# Altium schematic sheet 09_RTC.SchDoc: Power and Incoming USB
size A2; Organization: Greenfield Tech Solutions; Address1: Molendreef 33; Address2: Ossendrecht; Address3: 4641CS; Address4: The Netherlands; SheetNumber: 9; SheetTotal: 11
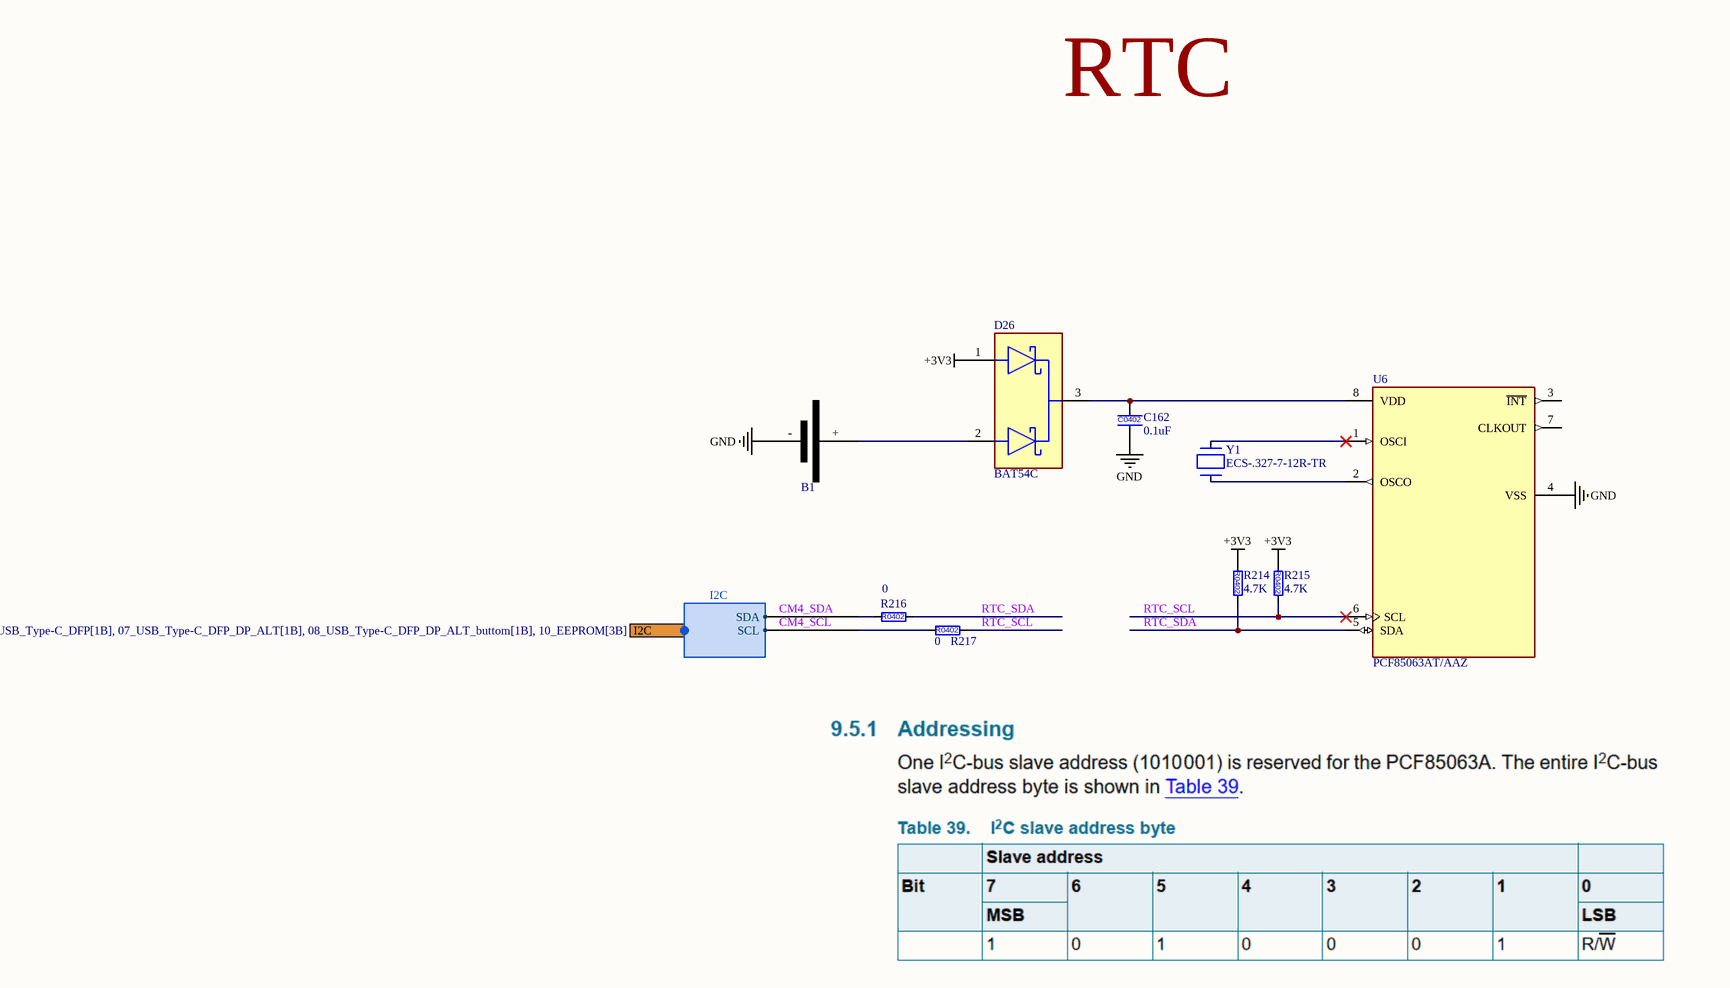
[diagram p0: 09_RTC.SchDoc]

## Parts
B1  BATTERY HOLDER CR1220  [BC501SM_CR1220]  (value not drawn)
C162  0.1uF  [C0402]
D26  BAT54C  [BAT54C_SOT_23_3]
R214  4.7K  [R0402]
R215  4.7K  [R0402]
R216  0  [R0402]
R217  0  [R0402]
U6  PCF85063AT/AAZ  [PCF85063AT_SOIC_8]
Y1  ECS-.327-7-12R-TR  [FP-ECX-12R-MFG]

## Ports
I2C (harness I2C, see 01_Top[3B], 03_RPiCM4[1B], 05_HDMI_to_DP[1B], 06_USB_Type-C_DFP[1B], 07_USB_Type-C_DFP_DP_ALT[1B], 08_USB_Type-C_DFP_DP_ALT_buttom[1B], 10_EEPROM[3B])

## Harnesses
I2C: SDA, SCL

## Nets
+3V3: D26.1(1_ANODE) R214.1 R215.1
GND: B1.- C162.2 U6.4(VSS)
CM4_SCL: R217.1 ; port I2C.SCL
CM4_SDA: R216.1 ; port I2C.SDA
RTC_SCL: R215.2 R217.2 U6.6(SCL)
RTC_SDA: R214.2 R216.2 U6.5(SDA)
NetB1_+: B1.+ D26.2(2_ANODE)
NetC162_1: C162.1 D26.3(COMMON_CATHODE) U6.8(VDD)
NetU6_1: U6.1(OSCI) Y1.1(In/Out)
NetU6_2: U6.2(OSCO) Y1.2(Out/In)

Not connected (* = marked no-connect by the designer): U6 3(~{INT}) 7(CLKOUT)

## Notes on the sheet
- RTC
- Title
- Size:
- Date:
- File:
- A2
- Number:
- Time:
- Revision:
- Sheet
- of
- (in symbol 04023D104KAT2A) C0402
- (in symbol CRCW04024K7FK) R0402
- (in symbol CRCW04020000Z0) R0402

## Library data of the parts
B1 = BC501SM: BATTERY HOLDER COIN 12MM SMD; Manufacturer: Memory Protection Devices; Number of Cells: 1; Supplier 1: Digi-Key; Manufacturer Part Number: BC501SM; RoHS: Yes; Category: Uncategorized; Stock 1: 4069; Pricing 1: 1=1.03000, 10=0.87200, 50=0.76400, 100=0.72030, 250=0.66312, 500=0.62272, 1000=0.58232, 2500=0.53183, 5000=0.49144 (USD); Mount: Surface Mount,PCB; Case/Package: SMD/SMT; Min Operating Temperature: -40°C; Max Operating Temperature: 85°C; Package Quantity: 200; Termination: SMD/SMT; ComponentLink1URL: https://datasheet.ciiva.com/4/bc501sm-datasheet-4073.pdf?src-supplier=Digi-Key; ComponentLink1Description: https://datasheet.ciiva.com/4/bc501sm-datasheet-4073.pdf?src-supplier=Digi-Key; Supplier Part Number 1: BC501SM-ND
C162 = 04023D104KAT2A: CAP CER  0.1uF 10% 25V X5R 0402; Manufacturer: AVX Corporation; Manufacturer Part Number: 04023D104KAT2A; Value: 0.1uF; Voltage - Rated: 25V; Tolerance: ±10%; Temperature Coefficient: X5R
D26 = BAT54C: BAT54 Series 30 V 200 mA Surface Mount Schottky Barrier Double Diode - SOT-23; Obsolete Part: true; Manufacturer: ON Semiconductor; Max Repetitive Reverse Voltage: 30V; Max Junction Temp: +150°C; Forward Current: 200mA; Peak Reverse Current: 2uA; Standoff Height: 0mm; Capacitance: 10pF; Max Surge Forward Current: 600mA; Value: 10pF; Element Configuration: Common Cathode; Forward Voltage: 800mV; Reverse Recovery Time: 5ns; Power Dissipation: 290mW; Current Rating: 200A; Device Class L3: Schottky Diodes; ComponentLink2Description: Datasheet; Category: Diode; ComponentLink2URL: https://media.digikey.com/pdf/Data%20Sheets/ON%20Semiconductor%20PDFs/BAT54(A,C,S).pdf; Package: MA03D; Octopart: https://octopart.com/bat54c-on+semiconductor-8095621; Height: 1.2mm; Reverse Voltage: 30V; Manufacturer Part Number: BAT54C; Automotive: No; Device Class L1: Discrete Semiconductors; Temperature Range Low: -55°C; Device Class L2: Diodes; Digikey Description: DIODE ARRAY SCHOTTKY 30V SOT23-3; Temperature: -55°C to +150°C; Temperature Range High: +150°C; Supplier 1: Farnell; RoHS: Yes; Pricing 1: 5=0.05820, 50=0.04540, 100=0.04420, 500=0.03510, 1500=0.03100 (EUR); Mount: Surface Mount; Case/Package: SOT-23; Number of Pins: 3; Contact Plating: Tin,Matte; Weight: 0.000882oz; Min Operating Temperature: -55°C; Max Operating Temperature: 150°C; Packaging: Cut Tape; Max Repetitive Reverse Voltage (Vrrm): 30V; Max Forward Surge Current (Ifsm): 600mA; Package Quantity: 1; Max Reverse Current: 2uA; Average Rectified Current: 200mA; Peak Non-Repetitive Surge Current: 600mA; Voltage Rating (DC): 30V; Max Reverse Voltage (DC): 30V; Series: -; Voltage: 30V; Length: 2.92mm; Width: 1.3mm; Radiation Hardening: No; RoHS Compliant: Yes; Lead Free: Lead Free; Reach SVHC Compliant: Yes; ComponentLink1URL: https://datasheet.ciiva.com/22651/1923830-22651948.pdf?src-supplier=Element14; ComponentLink1Description: https://datasheet.ciiva.com/22651/1923830-22651948.pdf?src-supplier=Element14; ComponentLink3URL: https://datasheet.ciiva.com/904/bat54-904342.pdf?src-supplier=Digi-Key; ComponentLink3Description: https://datasheet.ciiva.com/904/bat54-904342.pdf?src-supplier=Digi-Key; ComponentLink4URL: https://datasheet.ciiva.com/904/bat54-904343.pdf?src-supplier=Digi-Key; ComponentLink4Description: https://datasheet.ciiva.com/904/bat54-904343.pdf?src-supplier=Digi-Key; ComponentLink5URL: https://datasheet.ciiva.com/904/bat54-904341.pdf?src-supplier=Digi-Key; ComponentLink5Description: https://datasheet.ciiva.com/904/bat54-904341.pdf?src-supplier=Digi-Key; Supplier Part Number 1: 1467518
R214 R215 = CRCW04024K7FK: RES SMD 4.7K ohm 1% 1/16W R0402; Manufacturer: Vishay Dale; Manufacturer Part Number: CRCW04024K7FK; Value: 4.7K; Power (Watts): 1/16W; Package / Case: 0805 (2012 Metric); Tolerance: ±1%
R216 R217 = CRCW04020000Z0: RES SMD 0 ohm 1/16W R0402; Manufacturer: Vishay Dale; Manufacturer Part Number: CRCW04020000Z0; Value: 0; Power (Watts): 1/16W; Package / Case: 0402
U6 = PCF85063AT: PCF85063AT: 5.5 V Tiny Real-Time Clock/Calendar w/Alarm Function and I2C-bus; Manufacturer: NXP Semiconductors; Interface: I2C; Date Format: YY-MM-DD-dd; Time Format: HH:MM:SS (12/24 hr); RoHS Compliant: Yes; Mount: Surface Mount; Min Operating Temperature: -40°C; Lead Free: Lead Free; Packaging: Tape and Reel; Max Operating Temperature: 85°C; Case/Package: SOIC; Supplier 1: Mouser; Manufacturer Part Number: PCF85063AT/AAZ; RoHS: Yes; Category: Real Time Clocks; Stock 1: 46938; Pricing 1: 1=0.81000, 10=0.75400, 50=0.72800, 100=0.64200, 1000=0.49700, 10000=0.48900 (USD); ComponentLink1URL: http://www.farnell.com/datasheets/2617867.pdf?src-supplier=Farnell; ComponentLink1Description: http://www.farnell.com/datasheets/2617867.pdf?src-supplier=Farnell; ComponentLink2URL: http://www.nxp.com/documents/data_sheet/PCF85063A.pdf?src-supplier=Avnet; ComponentLink2Description: http://www.nxp.com/documents/data_sheet/PCF85063A.pdf?src-supplier=Avnet; Supplier Part Number 1: 771-PCF85063AT/AAZ
Y1 = ECS-.327-7-12R-TR: Crystal 0.032768MHz ±20ppm (Tol) 7pF Flexural 70000Ohm Automotive 2-Pin Ultra Mini-CSMD T/R; Manufacturer: ECS International; Supplier 1: Digi-Key; Manufacturer Part Number: ECS-.327-7-12R-TR; RoHS: Yes; Category: Crystals; Stock 1: 130928; Pricing 1: 1=0.79000, 10=0.69700, 50=0.65140, 100=0.57570, 500=0.54540, 1000=0.45450 (USD); ComponentLink1URL: https://www.ecsxtal.com/store/pdf/ECX-12R.pdf?src-supplier=Digi-Key; ComponentLink1Description: https://www.ecsxtal.com/store/pdf/ECX-12R.pdf?src-supplier=Digi-Key; Supplier Part Number 1: XC2743CT-ND